# Altium schematic sheet [21]-AXEL.SchDoc
size A4
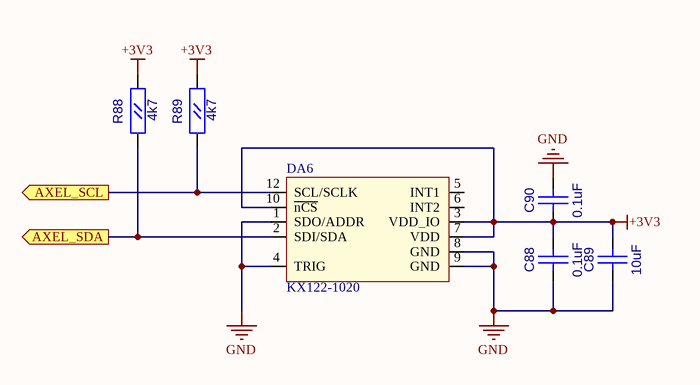
[diagram p0: [21]-AXEL.SchDoc]

## Parts
C88  0.1uF  [CC0603]
C89  10uF  [CC0805]
C90  0.1uF  [CC0603]
DA6  KX122-1020  [LGA-12]
R88  4k7  [RC0603]
R89  4k7  [RC0603]

## Ports
AXEL_SCL (out), AXEL_SDA (out)

## Nets
+3V3: C88.2(B) C89.2(B) C90.1(A) DA6.3(VDD_IO) DA6.7(VDD) DA6.10(~{nCS}) R88.2(B) R89.2(B)
GND: C88.1(A) C89.1(A) C90.2(B) DA6.1(SDO/ADDR) DA6.4(TRIG) DA6.8(GND) DA6.9(GND)
AXEL_SCL: DA6.12(SCL/SCLK) R89.1(A) ; port AXEL_SCL
AXEL_SDA: DA6.2(SDI/SDA) R88.1(A) ; port AXEL_SDA

Not connected (* = marked no-connect by the designer): DA6 5(INT1) 6(INT2)

## Library data of the parts
C88 C90 = CC0603: Value: 0.1uF
C89 = CC0805: Value: 10uF
DA6 = KX022-1020: Value: KX122-1020
R88 R89 = RC0603: Value: 4k7